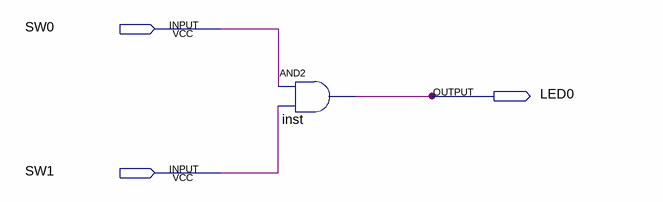
[diagram p0: schematic sheet]
// Quartus schematic exercise1.bdf as structural Verilog: 1 symbols, 3 pins
module exercise1 (
  input  SW0,
  input  SW1,
  output LED0
);

  and inst (LED0, SW0, SW1);
endmodule
